# Altium schematic sheet CorvetteALDL_Schematics_2024-03-25.schdoc
size 261 x 157 mm
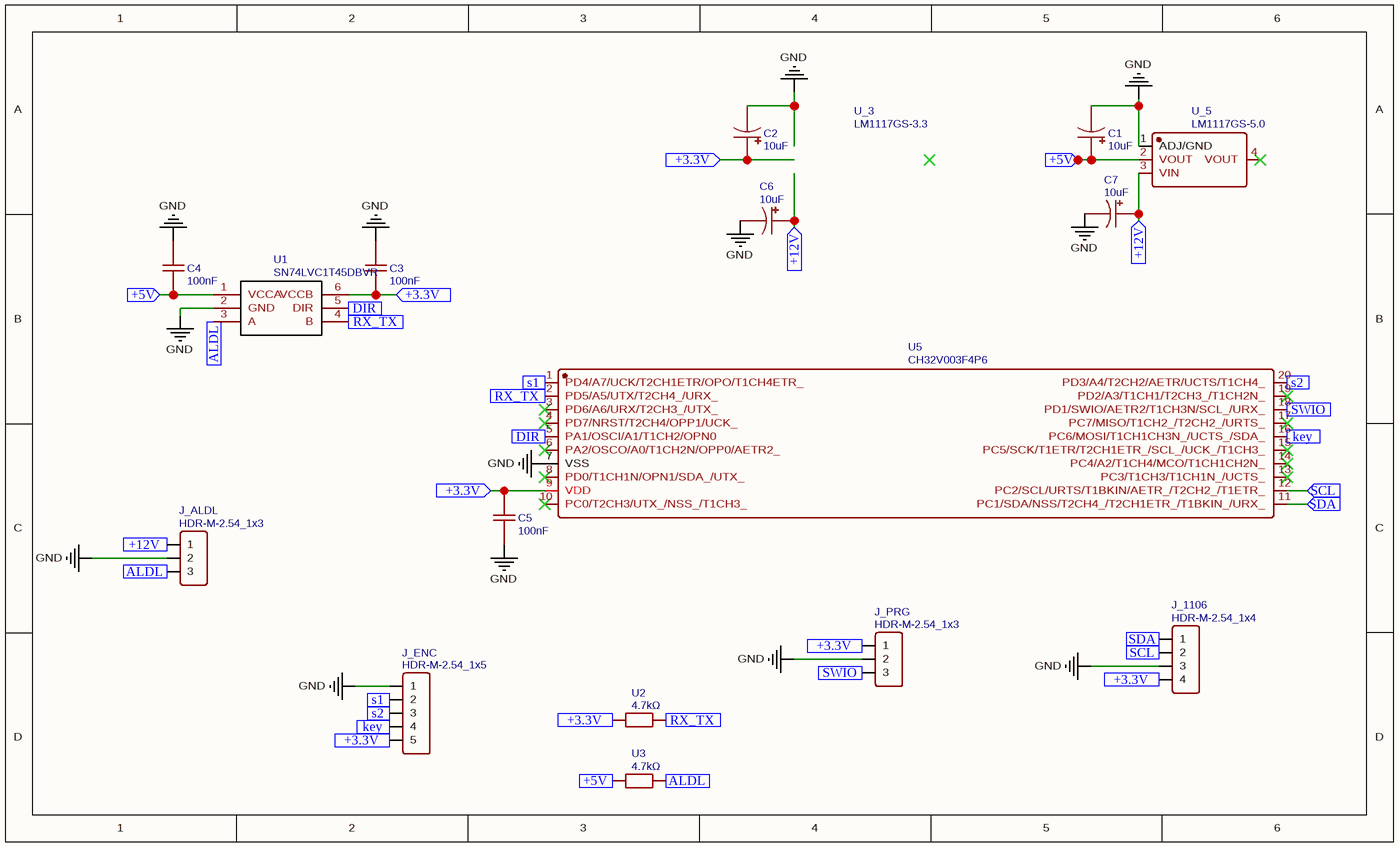
[diagram p0: CorvetteALDL_Schematics_2024-03-25.schdoc]

## Parts
C1  10uF  [CASE-A_3216]
C2  10uF  [CASE-A_3216]
C3  100nF  [C1206]
C4  100nF  [C1206]
C5  100nF  [C1206]
C6  10uF  [CASE-A_3216]
C7  10uF  [CASE-A_3216]
J_1106  HDR-M-2.54_1x4  [HDR-M-2.54_1X4]
J_ALDL  HDR-M-2.54_1x3  [HDR-M-2.54_1X3]
J_ENC  HDR-M-2.54_1x5  [HDR-M-2.54_1X5]
J_PRG  HDR-M-2.54_1x3  [HDR-M-2.54_1X3]
U1  SN74LVC1T45DBVR  [SOT-23-6_L2.9-W1.6-P0.95-LS2.8-BR]
U2  4.7kΩ  [R1206]
U3  4.7kΩ  [R1206]
U5  CH32V003F4P6  [TSSOP-20_L6.5-W4.4-P0.65-LS6.4-BL]
U_3  LM1117GS-3.3  [SOT-223-3_L6.5-W3.4-P2.30-LS7.0-BR]
U_5  LM1117GS-5.0  [SOT-223-3_L6.5-W3.4-P2.30-LS7.0-BR]

## Ports
+3.3V (in), +5V (in), +12V (in), ALDL (in), DIR (in), key (in), RX_TX (in), s1 (in), s2 (in), SCL (in), SDA (in), SWIO (in)

## Nets
GND: C1.2 C2.2 C3.1 C4.1 C5.2 C6.2 C7.2 J_1106.3 J_ALDL.2 J_ENC.1 J_PRG.2 U1.2(GND) U5.7(VSS) U_5.1(ADJ/GND)
+3.3V: C2.1 C3.2 C5.1 J_1106.4 J_ENC.5 J_PRG.1 U1.6(VCCB) U2.1 U5.9(VDD) ; port +3.3V
+5V: C1.1 C4.2 U1.1(VCCA) U3.1 U_5.2(VOUT) ; port +5V
+12V: C6.1 C7.1 J_ALDL.1 U_5.3(VIN) ; port +12V
ALDL: J_ALDL.3 U1.3(A) U3.2 ; port ALDL
DIR: U1.5(DIR) U5.5(PA1/OSCI/A1/T1CH2/OPN0) ; port DIR
key: J_ENC.4 U5.16(PC6/MOSI/T1CH1CH3N_/UCTS_/SDA_) ; port key
RX_TX: U1.4(B) U2.2 U5.2(PD5/A5/UTX/T2CH4_/URX_) ; port RX_TX
s1: J_ENC.2 U5.1(PD4/A7/UCK/T2CH1ETR/OPO/T1CH4ETR_) ; port s1
s2: J_ENC.3 U5.20(PD3/A4/T2CH2/AETR/UCTS/T1CH4_) ; port s2
SCL: J_1106.2 U5.12(PC2/SCL/URTS/T1BKIN/AETR_/T2CH2_/T1ETR_) ; port SCL
SDA: J_1106.1 U5.11(PC1/SDA/NSS/T2CH4_/T2CH1ETR_/T1BKIN_/URX_) ; port SDA
SWIO: J_PRG.3 U5.18(PD1/SWIO/AETR2/T1CH3N/SCL_/URX_) ; port SWIO

Not connected (* = marked no-connect by the designer): U5 3(PD6/A6/URX/T2CH3_/UTX_)* 4(PD7/NRST/T2CH4/OPP1/UCK_)* 6(PA2/OSCO/A0/T1CH2N/OPP0/AETR2_)* 8(PD0/T1CH1N/OPN1/SDA_/UTX_)* 10(PC0/T2CH3/UTX_/NSS_/T1CH3_)* 13(PC3/T1CH3/T1CH1N_/UCTS_)* 14(PC4/A2/T1CH4/MCO/T1CH1CH2N_)* 15(PC5/SCK/T1ETR/T2CH1ETR_/SCL_/UCK_/T1CH3_)* 17(PC7/MISO/T1CH2_/T2CH2_/URTS_)* 19(PD2/A3/T1CH1/T2CH3_/T1CH2N_)*; U_5 4(VOUT)*

## Library data of the parts
C1 C2 C6 C7 = 10uF: Manufacturer: ROHM(罗姆); Manufacturer Part: TCA1A106M8R; nameAlias: Value; Contributor: LCSC; Supplier: LCSC; Supplier Part: C184153; JLCPCB Part Class: Extended Part; link: https://lcsc.com/eda_search?q=C184153&%26type=1&ref=editor; spicePre: C; spiceSymbolName: TCA1A106M8R
C3-C5 = 100nF: Manufacturer: TDK; Manufacturer Part: C3216X7R2A104M160AA; Contributor: lcsc; nameAlias: Value; Supplier: LCSC; Supplier Part: C3883507; link: https://lcsc.com/eda_search?q=C3883507&%26type=1&ref=editor; spicePre: C; spiceSymbolName: C3216X7R2A104M160AA
J_1106 = HDR-M-2.54_1x4: Contributor: LCEDA_Lib; Supplier Part: C124378; Supplier: LCSC; spicePre: J; spiceSymbolName: HDR-M-2.54_1x4
J_ALDL J_PRG = HDR-M-2.54_1x3: Contributor: LCEDA_Lib; Supplier Part: C180248; Supplier: LCSC; spicePre: J; spiceSymbolName: HDR-M-2.54_1x3
J_ENC = HDR-M-2.54_1x5: Contributor: LCEDA_Lib; Supplier Part: C358687; Supplier: LCSC; spicePre: J; spiceSymbolName: HDR-M-2.54_1x5
U1 = SN74LVC1T45DBVR: Manufacturer: TI(德州仪器); Supplier: LCSC; Manufacturer Part: SN74LVC1T45DBVR; Supplier Part: C7843; JLCPCB Part Class: Extended Part; spicePre: U; spiceSymbolName: SN74LVC1T45DBVR
U2 U3 = 4.7kΩ: Manufacturer: FOJAN(富捷); Manufacturer Part: FRC1206J472 TS; nameAlias: Value; Contributor: lcsc; Supplier: LCSC; Supplier Part: C2907499; JLCPCB Part Class: Extended Part; spicePre: U; spiceSymbolName: FRC1206J472 TS
U5 = CH32V003F4P6: Manufacturer: null; Contributor: lcsc; Supplier: LCSC; Supplier Part: C5187096; Manufacturer Part: CH32V003F4P6; JLCPCB Part Class: Extended Part; link: https://lcsc.com/eda_search?q=C5187096&%26type=1&ref=editor; spicePre: U; spiceSymbolName: CH32V003F4P6
U_3 = LM1117GS-3.3: Manufacturer: HTC; Contributor: LCSC; Supplier: LCSC; Supplier Part: C411821; Manufacturer Part: LM1117GS-3.3; JLCPCB Part Class: Extended Part; link: https://lcsc.com/eda_search?q=C411821&%26type=1&ref=editor; spicePre: U; spiceSymbolName: LM1117GS-3.3
U_5 = LM1117GS-5.0: Manufacturer: HTC; Contributor: LCSC; Supplier: LCSC; Supplier Part: C465002; Manufacturer Part: LM1117GS-5.0; JLCPCB Part Class: Extended Part; link: https://lcsc.com/eda_search?q=C465002&%26type=1&ref=editor; spicePre: U; spiceSymbolName: LM1117GS-5.0